# EAGLE schematic open-jar-tester_individual_motor_pwm_driver (EAGLE 7.3.0)
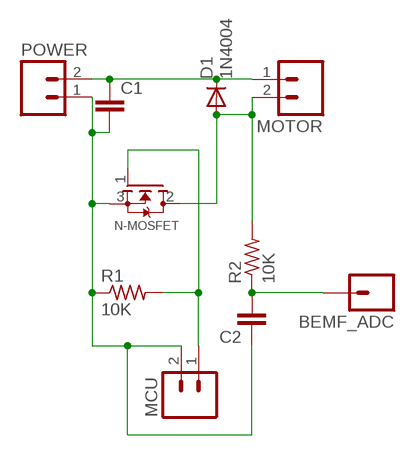
[diagram p0: schematic, sheet 1]

## Parts
BEMF_ADC  M01PTH  [1X01]
C1  CAPPTH  [CAP-PTH-SMALL]
C2  CAPPTH  [CAP-PTH-SMALL]
D1  1N4004  [DO41-10]
MCU  M02PTH  [1X02]
MOTOR  M02PTH  [1X02]
N-MOSFET  MOSFET-NGDS_TO220V  [TO220V]
POWER  M02PTH  [1X02]
R1  10K  R-US_0207/10  [0207/10]
R2  10K  R-US_0207/10  [0207/10]

## Nets
GND: C1.2 C2.1 MCU.2 N-MOSFET.3(S) POWER.1 R1.1
N$1: BEMF_ADC.1 C2.2 R2.1
N$2: MCU.1 N-MOSFET.1(G) R1.2
N$3: D1.A MOTOR.2 N-MOSFET.2(D) R2.2
N$4: C1.1 D1.C MOTOR.1 POWER.2

## Library data of the parts
BEMF_ADC = SparkFun-Connectors:M01: Header 1 Standard 1-pin 0.1" header. Use with straight break away headers (SKU : PRT-00116), right angle break away headers (PRT-00553), swiss pins (PRT-00743), machine pins (PRT-00117), and female headers (PRT-00115).
C1 C2 = SparkFun-Passives:CAP: Capacitor Standard 0603 ceramic capacitor, and 0.1" leaded capacitor.
D1 = diode:1N4004: DIODE general purpose rectifier, 1 A
MCU MOTOR POWER = SparkFun-Connectors:M02: Standard 2-pin 0.1" header. Use with - straight break away headers ( PRT-00116) - right angle break away headers (PRT-00553) - swiss pins (PRT-00743) - machine pins (PRT-00117) - female headers (PRT-00115) Molex polarized connector foot print use with: PRT-08233 with associated crimp pins and housings. 2.54_SCREWTERM for use with PRT-10571. 3.5mm Screw Terminal footprints for PRT-08084 5mm Screw Terminal footprints for use with PRT-08432
N-MOSFET = adafruit:MOSFET-N: N-Channel Mosfet 2N7002E - 60V 260mA SOT23 [Digikey: 2N7002ET1GOSTR-ND] - REEL BSH103 - 30V 850mA SOT23 [Digikey: 568-5013-1-ND]
R1 R2 = adafruit:R-US_: RESISTOR, American symbol